# Altium project VESA-ESP.PrjPcb
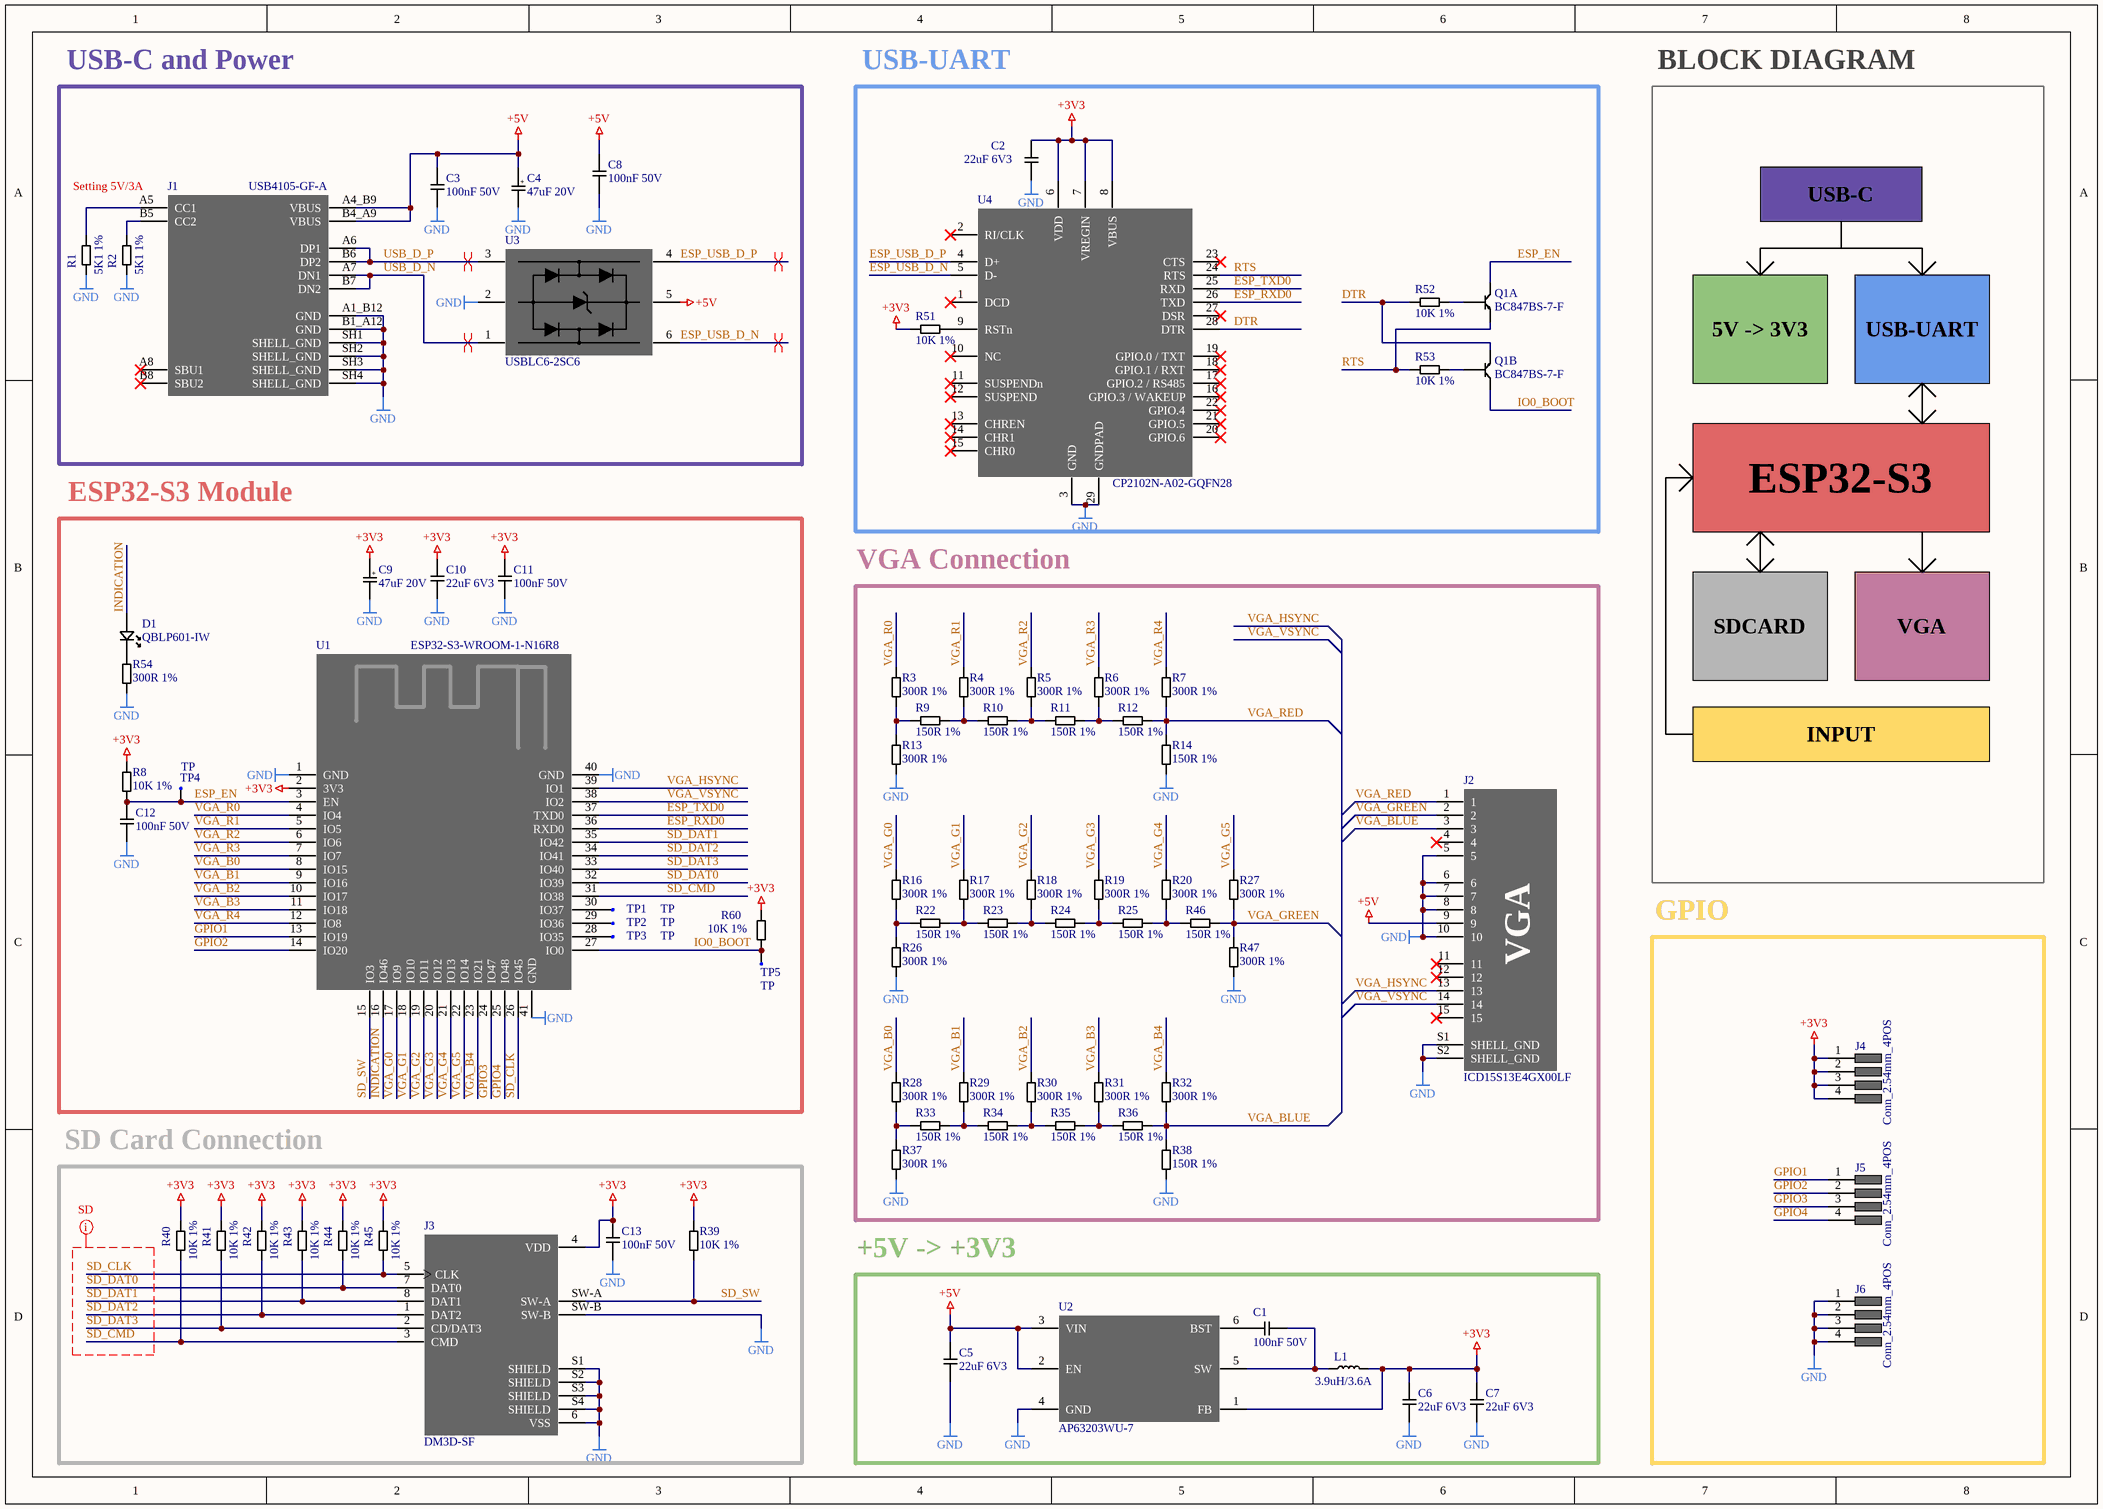
[diagram p0: Top.SchDoc]
1 sheet, 81 parts. Net scope: global (net labels, ports and power ports of the same name join across sheets).
Board file: Vesa-Esp.PcbDoc

## Sheet Top.SchDoc
size A3; SheetNumber: 1; SheetTotal: 1

### Parts
C1  100nF 50V  [CAPC1608X06N]
C2  22uF 6V3  [CAPC1608X06N]
C3  100nF 50V  [CAPC1608X06N]
C4  47uF 20V  [865080342006]
C5  22uF 6V3  [CAPC1608X06N]
C6  22uF 6V3  [CAPC1608X06N]
C7  22uF 6V3  [CAPC1608X06N]
C8  100nF 50V  [CAPC1608X06N]
C9  47uF 20V  [865080342006]
C10  22uF 6V3  [CAPC1608X06N]
C11  100nF 50V  [CAPC1608X06N]
C12  100nF 50V  [CAPC1608X06N]
C13  100nF 50V  [CAPC1608X06N]
D1  QBLP601-IW  [LEDC1608X06N]
J1  USB4105-GF-A  [USB4105-GF-A]
J2  ICD15S13E4GX00LF  [ICD15S13E4GX00LF]
J3  DM3D-SF  [DM3D-SF]
J4  Conn_2.54mm_4POS  [CONN_2.54MM_4POS]
J5  Conn_2.54mm_4POS  [CONN_2.54MM_4POS]
J6  Conn_2.54mm_4POS  [CONN_2.54MM_4POS]
L1  3.9uH/3.6A  [SDE0604A-3R9M]
Q1  BC847BS-7-F  [SOT65P210X110-6N]  (parts A,B of 2)
R1  5K1 1%  [RESC1608X06N]
R2  5K1 1%  [RESC1608X06N]
R3  300R 1%  [RESC1608X06N]
R4  300R 1%  [RESC1608X06N]
R5  300R 1%  [RESC1608X06N]
R6  300R 1%  [RESC1608X06N]
R7  300R 1%  [RESC1608X06N]
R8  10K 1%  [RESC1608X06N]
R9  150R 1%  [RESC1608X06N]
R10  150R 1%  [RESC1608X06N]
R11  150R 1%  [RESC1608X06N]
R12  150R 1%  [RESC1608X06N]
R13  300R 1%  [RESC1608X06N]
R14  150R 1%  [RESC1608X06N]
R16  300R 1%  [RESC1608X06N]
R17  300R 1%  [RESC1608X06N]
R18  300R 1%  [RESC1608X06N]
R19  300R 1%  [RESC1608X06N]
R20  300R 1%  [RESC1608X06N]
R22  150R 1%  [RESC1608X06N]
R23  150R 1%  [RESC1608X06N]
R24  150R 1%  [RESC1608X06N]
R25  150R 1%  [RESC1608X06N]
R26  300R 1%  [RESC1608X06N]
R27  300R 1%  [RESC1608X06N]
R28  300R 1%  [RESC1608X06N]
R29  300R 1%  [RESC1608X06N]
R30  300R 1%  [RESC1608X06N]
R31  300R 1%  [RESC1608X06N]
R32  300R 1%  [RESC1608X06N]
R33  150R 1%  [RESC1608X06N]
R34  150R 1%  [RESC1608X06N]
R35  150R 1%  [RESC1608X06N]
R36  150R 1%  [RESC1608X06N]
R37  300R 1%  [RESC1608X06N]
R38  150R 1%  [RESC1608X06N]
R39  10K 1%  [RESC1608X06N]
R40  10K 1%  [RESC1608X06N]
R41  10K 1%  [RESC1608X06N]
R42  10K 1%  [RESC1608X06N]
R43  10K 1%  [RESC1608X06N]
R44  10K 1%  [RESC1608X06N]
R45  10K 1%  [RESC1608X06N]
R46  150R 1%  [RESC1608X06N]
R47  300R 1%  [RESC1608X06N]
R51  10K 1%  [RESC1608X06N]
R52  10K 1%  [RESC1608X06N]
R53  10K 1%  [RESC1608X06N]
R54  300R 1%  [RESC1608X06N]
R60  10K 1%  [RESC1608X06N]
TP1  TP  [TESTPOINT]  (no BOM)
TP2  TP  [TESTPOINT]  (no BOM)
TP3  TP  [TESTPOINT]  (no BOM)
TP4  TP  [TESTPOINT]  (no BOM)
TP5  TP  [TESTPOINT]  (no BOM)
U1  ESP32-S3-WROOM-1-N16R8  [ESP32-S3-WROOM]
U2  AP63203WU-7  [SOT95P245X100-6N]
U3  USBLC6-2SC6  [SOT95P245X100-6N]
U4  CP2102N-A02-GQFN28  [QFN50P500X500X80-29N]

### Blocks framed on the sheet
Setting 5V/3A: C3 C4 C8 J1 R1 R2 U3

### Nets
+3V3: C2.2 C6.2 C7.2 C9.1 C10.2 C11.2 C13.2 J3.4(VDD) J4.1 J4.2 J4.3 J4.4 L1.2 R8.1 R39.1 R40.1 R41.1 R42.1 R43.1 R44.1 R45.1 R51.1 R60.1 U1.2(3V3) U2.1(FB) U4.6(VDD) U4.7(VREGIN) U4.8(VBUS)
+5V: C3.2 C4.1 C5.2 C8.2 J1.A4_B9(VBUS) J1.B4_A9(VBUS) J2.9 U2.2(EN) U2.3(VIN) U3.5
GND: C2.1 C3.1 C4.2 C5.1 C6.1 C7.1 C8.1 C9.2 C10.1 C11.1 C12.1 C13.1 J1.A1_B12(GND) J1.B1_A12(GND) J1.SH1(SHELL_GND) J1.SH2(SHELL_GND) J1.SH3(SHELL_GND) J1.SH4(SHELL_GND) J2.5 J2.6 J2.7 J2.8 J2.10 J2.S1(SHELL_GND) J2.S2(SHELL_GND) J3.6(VSS) J3.S1(SHIELD) J3.S2(SHIELD) J3.S3(SHIELD) J3.S4(SHIELD) J3.SW-B J6.1 J6.2 J6.3 J6.4 R1.1 R2.1 R13.1 R14.2 R26.1 R37.1 R38.2 R47.1 R54.1 U1.1(GND) U1.40(GND) U1.41(GND) U2.4(GND) U3.2 U4.3(GND) U4.29(GNDPAD)
DTR: Q1.1 R52.2 U4.28(DTR)
ESP_EN: C12.2 Q1.3 R8.2 TP4.1 U1.3(EN)
ESP_RXD0: U1.36(RXD0) U4.26(TXD)
ESP_TXD0: U1.37(TXD0) U4.25(RXD)
ESP_USB_D_N: U3.6 U4.5(D-)
ESP_USB_D_P: U3.4 U4.4(D+)
GPIO1: J5.1 U1.13(IO19)
GPIO2: J5.2 U1.14(IO20)
GPIO3: J5.3 U1.24(IO47)
GPIO4: J5.4 U1.25(IO48)
INDICATION: D1.1 U1.16(IO46)
IO0_BOOT: Q1.6 R60.2 TP5.1 U1.27(IO0)
RTS: Q1.4 R53.2 U4.24(RTS)
SD_CLK: J3.5(CLK) R45.2 U1.26(IO45)
SD_CMD: J3.3(CMD) R40.2 U1.31(IO38)
SD_DAT0: J3.7(DAT0) R44.2 U1.32(IO39)
SD_DAT1: J3.8(DAT1) R43.2 U1.35(IO42)
SD_DAT2: J3.1(DAT2) R42.2 U1.34(IO41)
SD_DAT3: J3.2(CD/DAT3) R41.2 U1.33(IO40)
SD_SW: J3.SW-A R39.2 U1.15(IO3)
USB_D_N: J1.A7(DN1) J1.B7(DN2) U3.1
USB_D_P: J1.A6(DP1) J1.B6(DP2) U3.3
VGA_B0: R28.1 U1.8(IO15)
VGA_B1: R29.1 U1.9(IO16)
VGA_B2: R30.1 U1.10(IO17)
VGA_B3: R31.1 U1.11(IO18)
VGA_B4: R32.1 U1.23(IO21)
VGA_BLUE: J2.3 R32.2 R36.2 R38.1
VGA_G0: R16.1 U1.17(IO9)
VGA_G1: R17.1 U1.18(IO10)
VGA_G2: R18.1 U1.19(IO11)
VGA_G3: R19.1 U1.20(IO12)
VGA_G4: R20.1 U1.21(IO13)
VGA_G5: R27.1 U1.22(IO14)
VGA_GREEN: J2.2 R27.2 R46.2 R47.2
VGA_HSYNC: J2.13 U1.39(IO1)
VGA_R0: R3.1 U1.4(IO4)
VGA_R1: R4.1 U1.5(IO5)
VGA_R2: R5.1 U1.6(IO6)
VGA_R3: R6.1 U1.7(IO7)
VGA_R4: R7.1 U1.12(IO8)
VGA_RED: J2.1 R7.2 R12.2 R14.1
VGA_VSYNC: J2.14 U1.38(IO2)
NetC1_1: C1.1 L1.1 U2.5(SW)
NetC1_2: C1.2 U2.6(BST)
NetD1_2: D1.2 R54.2
NetJ1_A5: J1.A5(CC1) R1.2
NetJ1_B5: J1.B5(CC2) R2.2
NetQ1_2: Q1.2 R53.1
NetQ1_5: Q1.5 R52.1
NetR3_2: R3.2 R9.1 R13.2
NetR4_2: R4.2 R9.2 R10.1
NetR5_2: R5.2 R10.2 R11.1
NetR6_2: R6.2 R11.2 R12.1
NetR16_2: R16.2 R22.1 R26.2
NetR17_2: R17.2 R22.2 R23.1
NetR18_2: R18.2 R23.2 R24.1
NetR19_2: R19.2 R24.2 R25.1
NetR20_2: R20.2 R25.2 R46.1
NetR28_2: R28.2 R33.1 R37.2
NetR29_2: R29.2 R33.2 R34.1
NetR30_2: R30.2 R34.2 R35.1
NetR31_2: R31.2 R35.2 R36.1
NetR51_2: R51.2 U4.9(RSTn)
NetTP1_1: TP1.1 U1.30(IO37)
NetTP2_1: TP2.1 U1.29(IO36)
NetTP3_1: TP3.1 U1.28(IO35)

Not connected (* = marked no-connect by the designer): J1 A8(SBU1)* B8(SBU2)*; J2 4* 11* 12* 15*; U4 1(DCD)* 2(RI/CLK)* 10(NC)* 11(SUSPENDn)* 12(SUSPEND)* 13(CHREN)* 14(CHR1)* 15(CHR0)* 16(GPIO.3_/_WAKEUP)* 17(GPIO.2_/_RS485)* 18(GPIO.1_/_RXT)* 19(GPIO.0_/_TXT)* 20(GPIO.6)* 21(GPIO.5)* 22(GPIO.4)* 23(CTS)* 27(DSR)*

### Layout directives
differential pair: ESP_USB_D_N, ESP_USB_D_P, USB_D_N, USB_D_P
net class SD: SD_CLK, SD_CMD, SD_DAT0, SD_DAT1, SD_DAT2, SD_DAT3

### Notes on the sheet
- USB-C and Power
- USB-UART
- BLOCK DIAGRAM
- USB-C
- 5V -> 3V3
- ESP32-S3 Module
- ESP32-S3
- VGA Connection
- SDCARD
- VGA
- INPUT
- GPIO
- SD Card Connection
- +5V -> +3V3
- (in symbol 47uF 20V) +
- (in symbol ICD15S13E4GX00LF) VGA

### Library data of the parts
C1 C3 C8 C11-C13 = 100nF 50V: 0.1 µF ±10% 50V Ceramic Capacitor X7R 0603 (1608 Metric); MPN: GCM188R71H104KA57D
C2 C5-C7 C10 = 22uF 6V3: 22 µF ±20% 6.3V Ceramic Capacitor X5R 0603 (1608 Metric); MPN: GRM188R60J226MEA0D
C4 C9 = 47uF 20V: 47 µF 16 V Aluminum Electrolytic Capacitors Radial, Can - SMD 2000 Hrs @ 105°C
  C4: Manufacturer Part Number 1: 865080342006
  C9: MPN: 865080342006
D1 = LED WHITE: White LED Indication - Discrete 3.2V 0603 (1608 Metric); MPN: QBLP601-IW
J1 = USB4105-GF-A: USB-C (USB TYPE-C) USB 2.0 Receptacle Connector 24 (16+8 Dummy) Position Surface Mount, Right Angle; Through Hole; MPN: USB4105-GF-A
J2 = ICD15S13E4GX00LF: 15 Position D-Sub, High Density Receptacle, Female Sockets Connector; MPN: ICD15S13E4GX00LF
J3 = DM3D-SF: 10 (8 + 2) Position Card Connector Secure Digital - microSD™ Surface Mount, Right Angle Gold; MPN: DM3D-SF
J4-J6 = Conn_2.54mm_4POS_1
L1 = 3.9uH/3.6A: FIXED IND 3.9UH 3.6A 65 MOHM SMD; MPN: SDE0604A-3R9M
Q1 = BC847BS-7-F: Bipolar (BJT) Transistor Array 2 NPN (Dual) 45V 100mA 100MHz 200mW Surface Mount SOT-363; MPN: BC847BS-7-F
R1 R2 = 5K1 1%: 5.1 kOhms ±1% 0.1W, 1/10W Chip Resistor 0603 (1608 Metric) Automotive AEC-Q200 Thick Film; MPN: ERJ-3EKF5101V
R3-R7 R13 R16-R20 R26-R32 R37 R47 R54 = 300R 1%: 300 Ohms ±1% 0.1W, 1/10W Chip Resistor 0603 (1608 Metric) Automotive AEC-Q200 Thick Film; MPN: ERJ-3EKF3000V
R8 R39-R45 R51-R53 R60 = 10K 1%: 10 kOhms ±1% 0.1W, 1/10W Chip Resistor 0603 (1608 Metric) Automotive AEC-Q200 Thick Film; MPN: ERJ-3EKF1002V
R9-R12 R14 R22-R25 R33-R36 R38 R46 = 150R 1%: 150 Ohms ±1% 0.1W, 1/10W Chip Resistor 0603 (1608 Metric) Automotive AEC-Q200 Thick Film; MPN: ERJ-3EKF1500V
TP1-TP5 = TP: Test Point
U1 = ESP32-S3-WROOM-1-N16R8: Bluetooth, WiFi 802.11b/g/n, Bluetooth v5.0 Transceiver Module 2.4GHz PCB Trace Surface Mount; MPN: ESP32-S3-WROOM-1-N16R8
U2 = AP63203WU-7: Buck Switching Regulator IC Positive Fixed 3.3V 1 Output 2A SOT-23-6 Thin, TSOT-23-6; MPN: AP63203WU-7
U3 = USBLC6-2SC6: 17V Clamp 5A (8/20µs) Ipp Tvs Diode Surface Mount SOT-23-6; MPN: USBLC6-2SC6
U4 = CP2102N-A02-GQFN28: USB Bridge, USB to UART USB 2.0 UART Interface 28-QFN (5x5); MPN: CP2102N-A02-GQFN28

## Assembly variants
Manufacturing: not fitted R15 R15 R48 R55 R57 R59 R60